# EAGLE design proMinimotor (EAGLE 9.2.2)
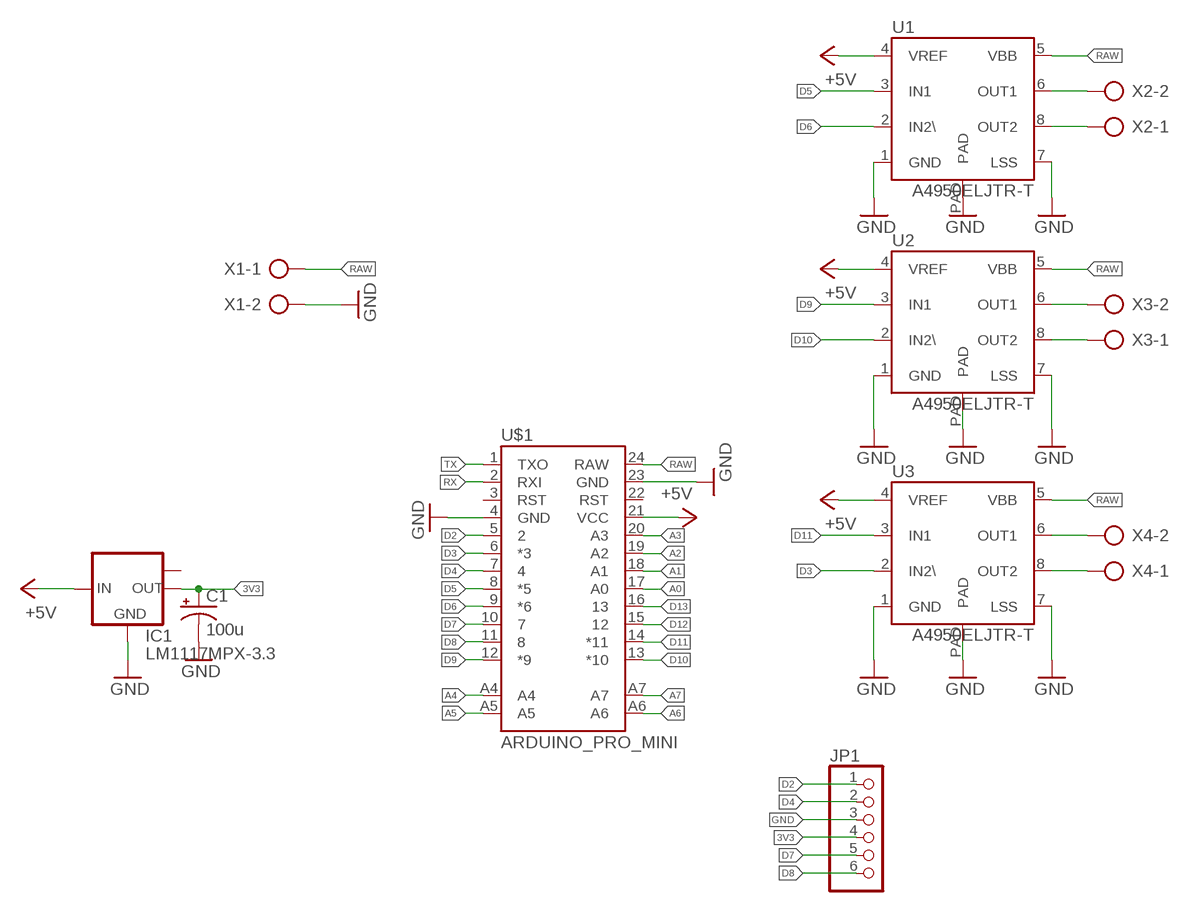
[diagram p0: schematic, sheet 1]

## Parts
C1  100u  CPOL-USE2.5-7  [E2,5-7]
IC1  LM1117MPX-3.3  [SOT223]
JP1  PINHD-1X6/90  [1X06/90]
U1  A4950ELJTR-T  [SOIC8TP]
U2  A4950ELJTR-T  [SOIC8TP]
U3  A4950ELJTR-T  [SOIC8TP]
U$1  ARDUINO_PRO_MINI  [ARDUINO_PRO_MINI]
X1  AK500/2  [AK500/2]
X2  AK500/2  [AK500/2]
X3  AK500/2  [AK500/2]
X4  AK500/2  [AK500/2]

## Nets
3V3: C1.+ IC1.2(OUT) JP1.4
+5V: IC1.3(IN) U1.4(VREF) U2.4(VREF) U3.4(VREF) U$1.21(VCC)
A0: U$1.17(A0)
A1: U$1.18(A1)
A2: U$1.19(A2)
A3: U$1.20(A3)
A4: U$1.A4
A5: U$1.A5
A6: U$1.A6
A7: U$1.A7
D2: JP1.1 U$1.5
D3: U3.2(IN2\) U$1.6(*3)
D4: JP1.2 U$1.7
D5: U1.3(IN1) U$1.8(*5)
D6: U1.2(IN2\) U$1.9(*6)
D7: JP1.5 U$1.10
D8: JP1.6 U$1.11
D9: U2.3(IN1) U$1.12(*9)
D10: U2.2(IN2\) U$1.13(*10)
D11: U3.3(IN1) U$1.14(*11)
D12: U$1.15
D13: U$1.16
GND: C1.- IC1.1(GND) JP1.3 U1.1(GND) U1.7(LSS) U1.PAD U2.1(GND) U2.7(LSS) U2.PAD U3.1(GND) U3.7(LSS) U3.PAD U$1.4(GND) U$1.23(GND) X1.2
N$1: U1.8(OUT2) X2.1
N$2: U1.6(OUT1) X2.2
N$3: U2.8(OUT2) X3.1
N$4: U2.6(OUT1) X3.2
N$5: U3.8(OUT2) X4.1
N$6: U3.6(OUT1) X4.2
RAW: U1.5(VBB) U2.5(VBB) U3.5(VBB) U$1.24(RAW) X1.1
RX: U$1.2(RXI)
TX: U$1.1(TXO)
Unconnected: IC1.TAB(OUT1) U$1.3(RST) U$1.22(RST)

## Library data of the parts
C1 = rcl:CPOL-US: POLARIZED CAPACITOR, American symbol; SPICEPREFIX: C
IC1 = lm1117:LM1117MPX-*
JP1 = pinhead:PINHD-1X6: PIN HEADER
U1-U3 = allegro:A4950ELJTR-T: IC MOTOR DRIVER PAR 8SOIC tested: YES (parallel gripper mcb)
U$1 = SparkFun-Boards:ARDUINO_PRO_MINI
X1-X4 = con-ptr500:AK500/2: CONNECTOR; OC_FARNELL: unknown; OC_NEWARK: unknown

## Board
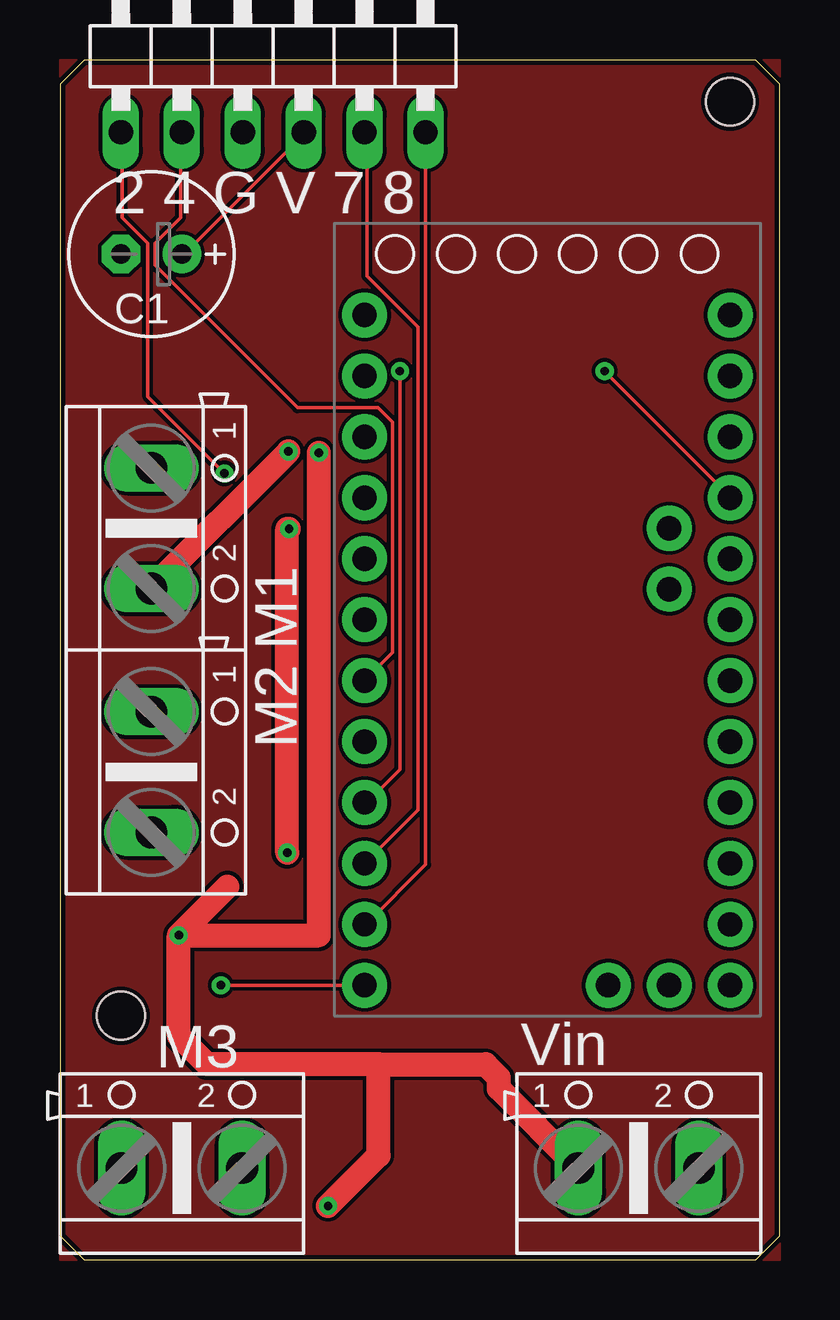
[diagram p1: board, top side]
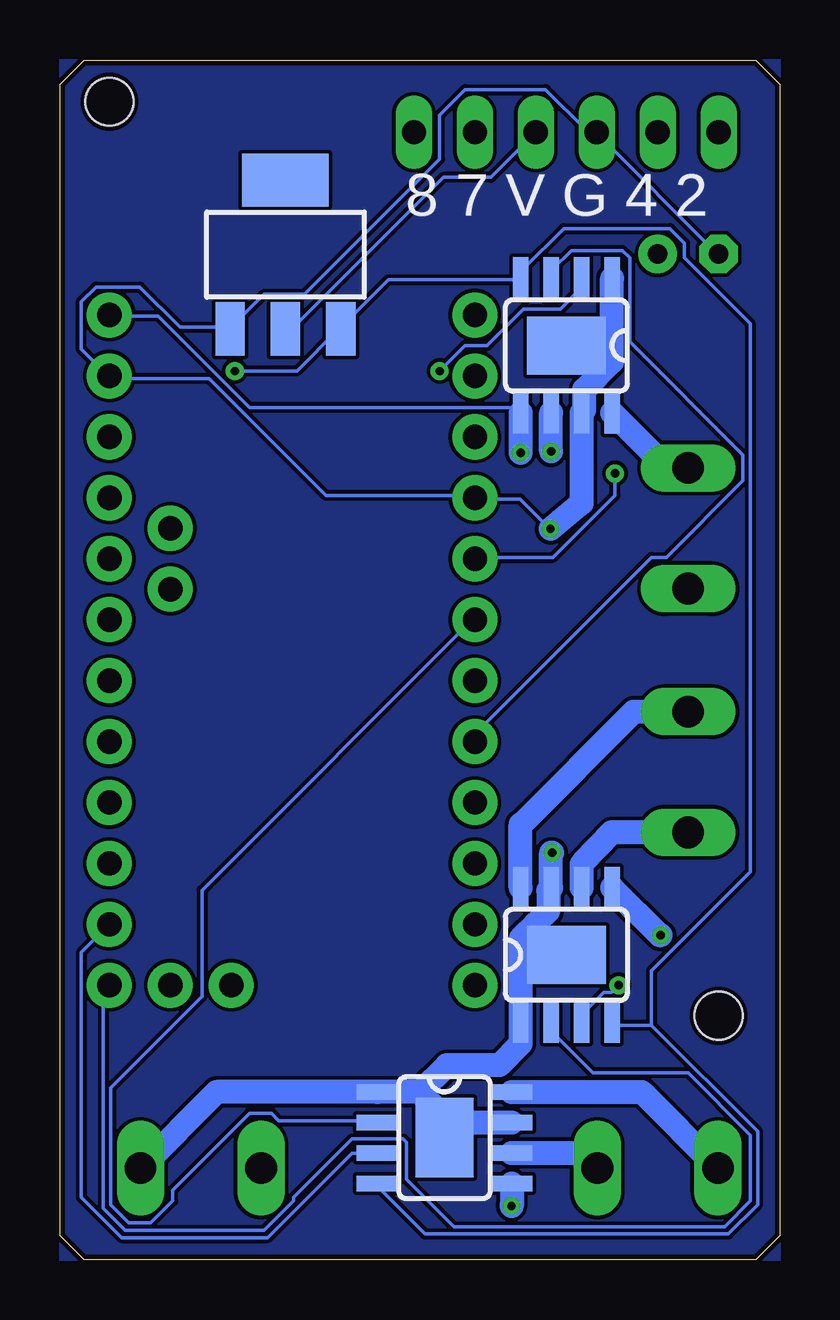
[diagram p2: board, bottom side, seen from below]

Size 30 x 50 mm. Coordinates in mm from the lower left corner, seen from the top.
Outline: 0,49 0,1 1,0 29,0 30,1 30,49 29,50 1,50 0,49
Copper layers (1*16): Top 0.035mm / dielectric 1.5mm / Bottom 0.035mm
Design rules "default *": minimum track width 6mil, minimum drill 0.35mm, track to track 6mil, track to pad 6mil, pad to pad 6mil, via to via 6mil, smd to smd 6mil, copper to edge 8mil, drill to drill 6mil, minimum pad ring 10mil, minimum via ring 8mil, stop-mask expansion 4mil, vias tented up to drill 0.5mm, thermal gap 10mil
Holes 2 mm at 27.94,48.26 2.54,10.16

### Footprints (pad centres in the part's own frame; a part is rotated, then mirrored left to right if it is on the bottom)
E2,5-7 = drill 0.813 pad 1.6: + -1.27,0 | drill 0.813 pad 1.6 octagon: - 1.27,0
SOT223 = smd 1.219 x 2.235: 1 -2.311,-3.099; 2 0,-3.099; 3 2.311,-3.099 | smd 3.6 x 2.2: TAB 0,3.099
1X06/90 = drill 1.016 long: 1 -6.35,-3.81; 2 -3.81,-3.81; 3 -1.27,-3.81; 4 1.27,-3.81; 5 3.81,-3.81; 6 6.35,-3.81
SOIC8TP = smd 1.75 x 0.65: 1 -2.8,1.905; 2 -2.8,0.635; 3 -2.8,-0.635; 4 -2.8,-1.905; 5 2.8,-1.905; 6 2.8,-0.635; 7 2.8,0.635; 8 2.8,1.905 | smd 2.41 x 3.3: PAD 0,0
ARDUINO_PRO_MINI = drill 1.016 pad 1.88: 1 -7.62,12.7; 2 -7.62,10.16; 3 -7.62,7.62; 4 -7.62,5.08; 5 -7.62,2.54; 6 -7.62,0; 7 -7.62,-2.54; 8 -7.62,-5.08; 9 -7.62,-7.62; 10 -7.62,-10.16; 11 -7.62,-12.7; 12 -7.62,-15.24; 13 7.62,-15.24; 14 7.62,-12.7; 15 7.62,-10.16; 16 7.62,-7.62; 17 7.62,-5.08; 18 7.62,-2.54; 19 7.62,0; 20 7.62,2.54; 21 7.62,5.08; 22 7.62,7.62; 23 7.62,10.16; 24 7.62,12.7; A4 5.08,1.27; A5 5.08,3.81; A6 2.54,-15.24; A7 5.08,-15.24
AK500/2 = drill 1.321 long: 1 -2.515,0; 2 2.515,0

### Placement (x,y rotation side)
C1  3.81,41.91 180 top
IC1  20.6,41.88 0 bottom
JP1  8.89,50.8 0 top
U1  8.89,38.1 270 bottom
U2  8.89,12.7 90 bottom
U3  13.97,5.08 0 bottom
U$1  20.32,26.67 0 top
X1  24.13,3.81 0 top
X2  3.81,30.48 270 top
X3  3.81,20.32 270 top
X4  5.08,3.81 0 top

### Tracks (layer width: path | path; a pad name or v marks a point on that pad's centre or on a via)
3V3
  Top 0.152: C1.+ 5.18,41.91 10.21,46.94 JP1.4
  Bottom 0.152: JP1.4 12.04,45.11 14.02,45.11 20.27,38.86 20.57,38.86 IC1.2
+5V  (via drill 0.35)
  Top 0.152: v22.71,37.03 27.89,31.85 U$1.21
  Bottom 0.152: 5.33,9.75 6.86,9.75 U2.4 | 5.33,9.75 0.91,5.33 0.91,2.29 2.13,1.07 14.78,1.07 16.76,3.05 U3.4 | v22.71,37.03 20.12,37.03 18.44,38.71 IC1.3 18.29,38.86 16.31,40.84 10.82,40.84 U1.4 10.67,41 10.67,41.3 8.99,42.98 4.57,42.98 3.96,42.37 3.96,41.76 1.22,39.01 1.22,16.15 5.33,12.04 5.33,9.75
D2  (via drill 0.35)
  Top 0.152: v6.86,32.77 3.66,35.97 3.66,42.37 2.59,43.43 2.59,46.94 JP1.1
  Bottom 0.152: v6.86,32.77 6.86,31.85 9.45,29.26 12.65,29.26 U$1.5
D3
  Bottom 0.152: U3.2 16.92,5.79 20.88,5.79 21.18,6.1 22.1,6.1 25.3,2.9 25.3,2.44 26.21,1.52 27.13,1.52 27.89,2.29 27.89,7.16 24.08,10.97 24.08,15.39 12.8,26.67 U$1.6
D4
  Top 0.152: U$1.7 13.87,25.3 13.87,34.9 13.26,35.51 9.91,35.51 3.96,41.45 3.96,42.37 5.03,43.43 5.03,46.94 JP1.2
D5
  Bottom 0.152: U1.3 9.45,41 9.45,41.3 8.69,42.06 6.55,42.06 6.25,41.76 6.25,38.25 1.52,33.53 1.52,32.46 4.72,29.26 5.33,29.26 12.65,21.95 12.65,21.64 U$1.8
D6  (via drill 0.35)
  Top 0.152: v14.17,37.03 14.17,20.42 12.8,19.05 U$1.9
  Bottom 0.152: v14.17,37.03 13.11,38.1 12.19,38.1 10.67,39.62 9.14,39.62 8.38,40.39 8.38,40.84 U1.2
D7
  Top 0.152: U$1.10 14.94,18.75 14.94,38.86 12.8,41 12.8,46.94 JP1.5
D8
  Top 0.152: JP1.6 15.24,16.46 12.8,14.02 U$1.11
D9  (via drill 0.35)
  Top 0.152: U$1.12 v6.71,11.43
  Bottom 0.152: v6.71,11.43 7.01,11.12 7.32,11.12 8.23,10.21 8.23,9.91 U2.3
D10
  Bottom 0.152: U2.2 9.45,9.75 9.45,9.45 7.77,7.77 3.81,7.77 1.22,5.18 1.22,2.44 2.29,1.37 13.56,1.37 15.54,3.35 15.54,4.88 15.7,5.03 17.83,5.03 20.27,2.59 20.27,2.44 21.49,1.22 27.28,1.22 28.19,2.13 28.19,11.28 28.04,11.43 U$1.13
D11
  Bottom 0.152: U$1.14 29.11,12.8 29.11,2.59 27.43,0.91 21.34,0.91 17.83,4.42 16.92,4.42 U3.3
GND  (via drill 0.35)
  Top 1: v9.47,16.96 9.47,30.45 v9.55,30.45
  Bottom 0.152: C1.- 2.59,41.91 7.62,46.94 JP1.3 7.62,47.09 8.08,47.09 9.75,48.77 13.11,48.77 14.17,47.7 14.17,45.87 19.81,40.23 21.49,40.23 22.86,38.86 IC1.1 23.01,38.86 24.99,38.86 26.67,40.54 28.5,40.54 29.11,39.93 29.11,37.95 28.04,36.88 U$1.23 27.89,36.73 23.77,36.73 18.9,31.85 12.8,31.85 U$1.4 12.65,31.7 10.82,31.7 9.91,30.79 v9.55,30.45 | 10.18,13.99 U2.PAD | 7.57,36.83 8.84,38.1 U1.PAD
  Bottom 1: U1.1 6.99,37.42 7.57,36.83 8.14,36.27 8.14,35.42 U1.7 8.26,31.52 v9.55,30.45 | 15.01,6.99 U3.1 23.47,6.99 X1.2 | 13.74,5.71 15.01,6.99 | 13.74,5.71 U3.7 | U3.PAD 13.97,5.49 13.74,5.71 | 15.01,6.99 14.99,6.99 13.87,8.1 11.68,8.1 10.79,8.99 U2.1 10.79,13.38 10.18,13.99 9.64,14.53 9.64,15.38 U2.7 9.53,16.96 v9.47,16.96
N$1
  Bottom 1: X2.1 4.68,32.99 U1.8
N$2  (via drill 0.35)
  Top 1: X2.2 v9.53,33.68
  Bottom 1: v9.53,33.68 U1.6
N$3
  Bottom 1: U2.8 10.79,18.14 10.77,18.14 6.08,22.84 X3.1
N$4
  Bottom 1: U2.6 8.26,16.48 8.19,16.55 6.99,17.8 X3.2
N$5
  Bottom 1: U3.8 5.74,6.99 X4.1
N$6
  Bottom 1: U3.6 8.23,4.45 X4.2
N$7
  pour Bottom: 0,0 30,0 30,50 0,50
N$8
  pour Top: 0,0 30,0 30,50 0,50
RAW  (via drill 0.35)
  Top 1: X1.1 18.3,7.13 18.3,7.58 17.74,8.14 13.28,8.14 | 13.28,8.14 6.14,8.14 4.95,9.32 v4.95,13.51 | v11.18,2.23 13.28,4.34 13.28,8.14 | v4.95,13.51 6.99,15.54 | v4.95,13.51 10.79,13.51 v10.79,33.63
  Bottom 0.152: U$1.24 27.89,39.32 25.91,39.32 22.1,35.51 11.28,35.51 U1.5
  Bottom 1: U1.5 v10.79,33.63 | U3.5 11.15,3.16 11.15,2.31 11.18,2.29 v11.18,2.23 | U2.5 5,13.51 v4.95,13.51

### Text on the board
tPlace: 2 4 G V 7 8 | M1 | M2 | M3 | Vin
bPlace: 8 7 V G 4 2